# Altium schematic sheet Microcontroller.SchDoc
size E; DocumentNumber: 2; SheetNumber: 2; SheetTotal: 4
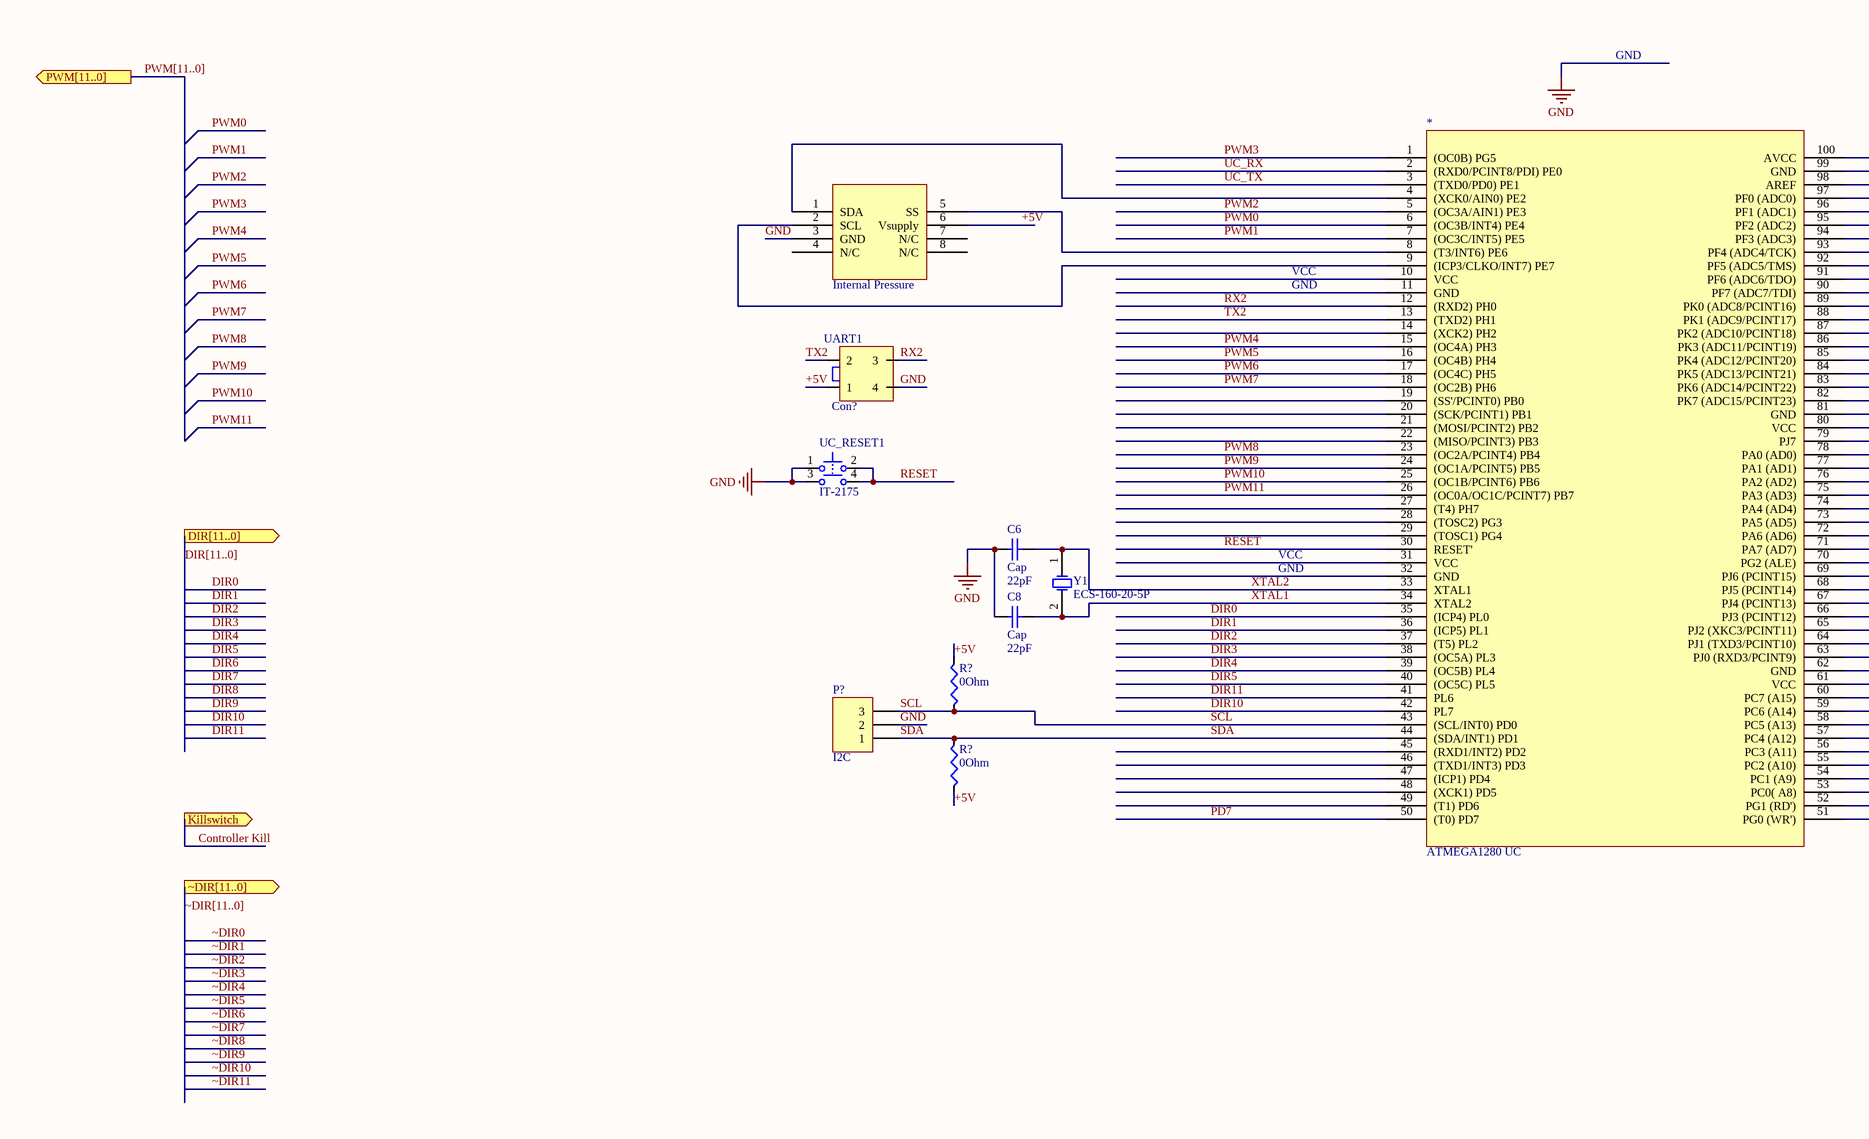
[diagram p0: Microcontroller.SchDoc, left]
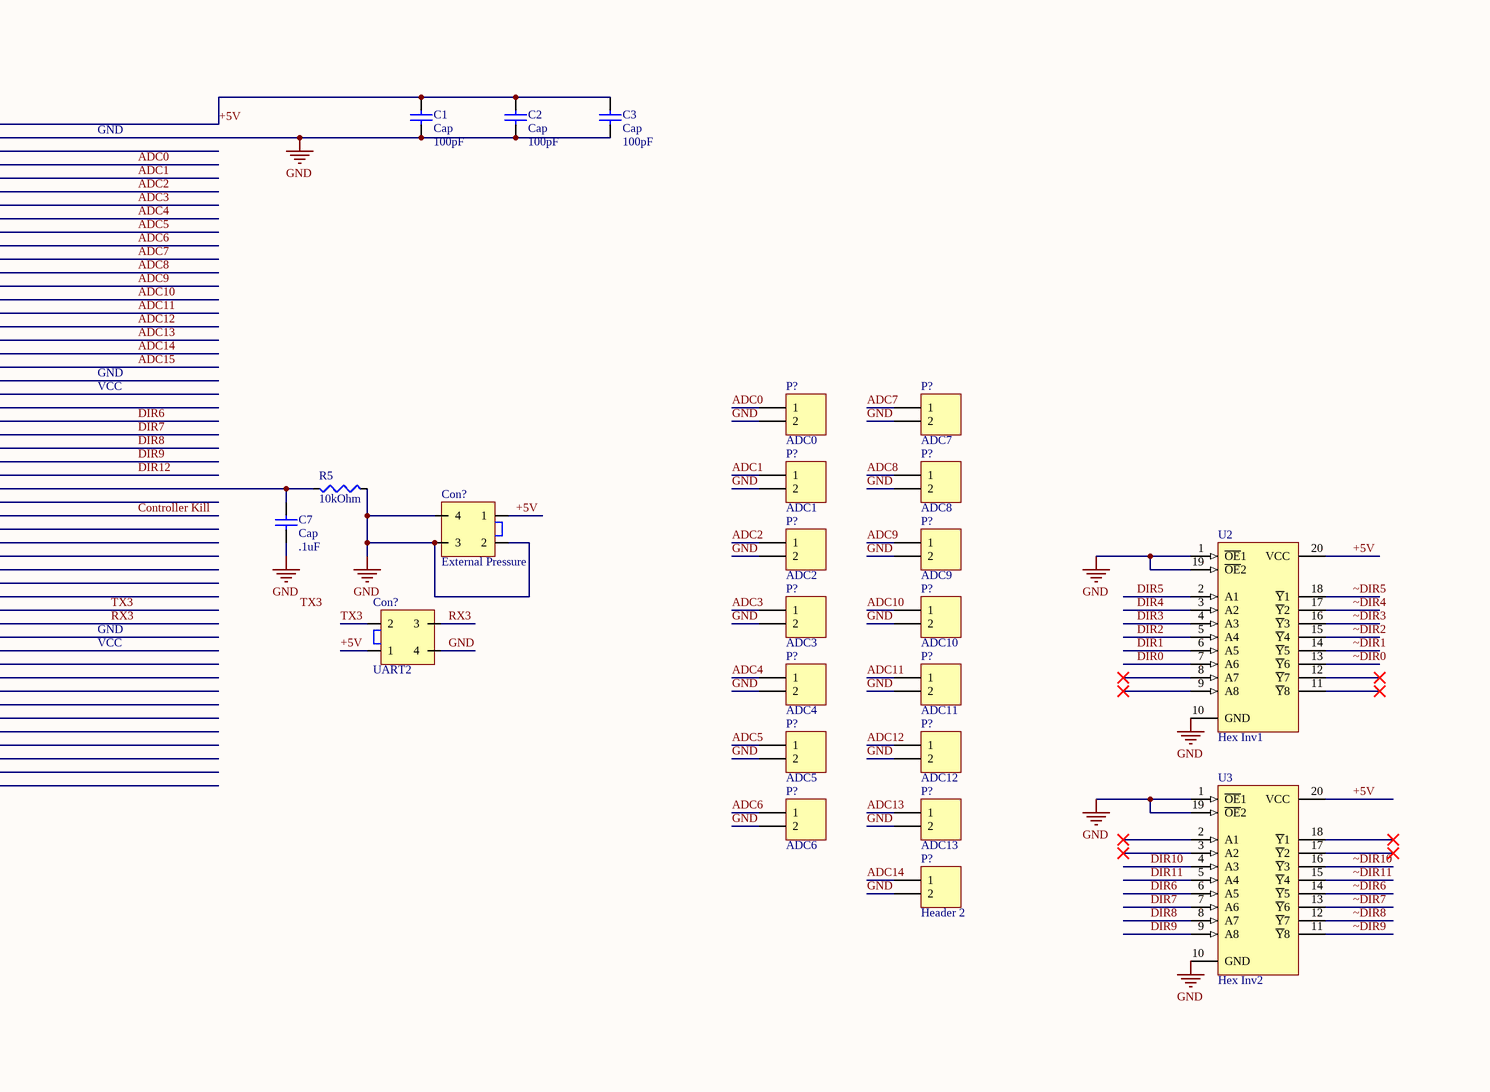
[diagram p1: Microcontroller.SchDoc, middle]
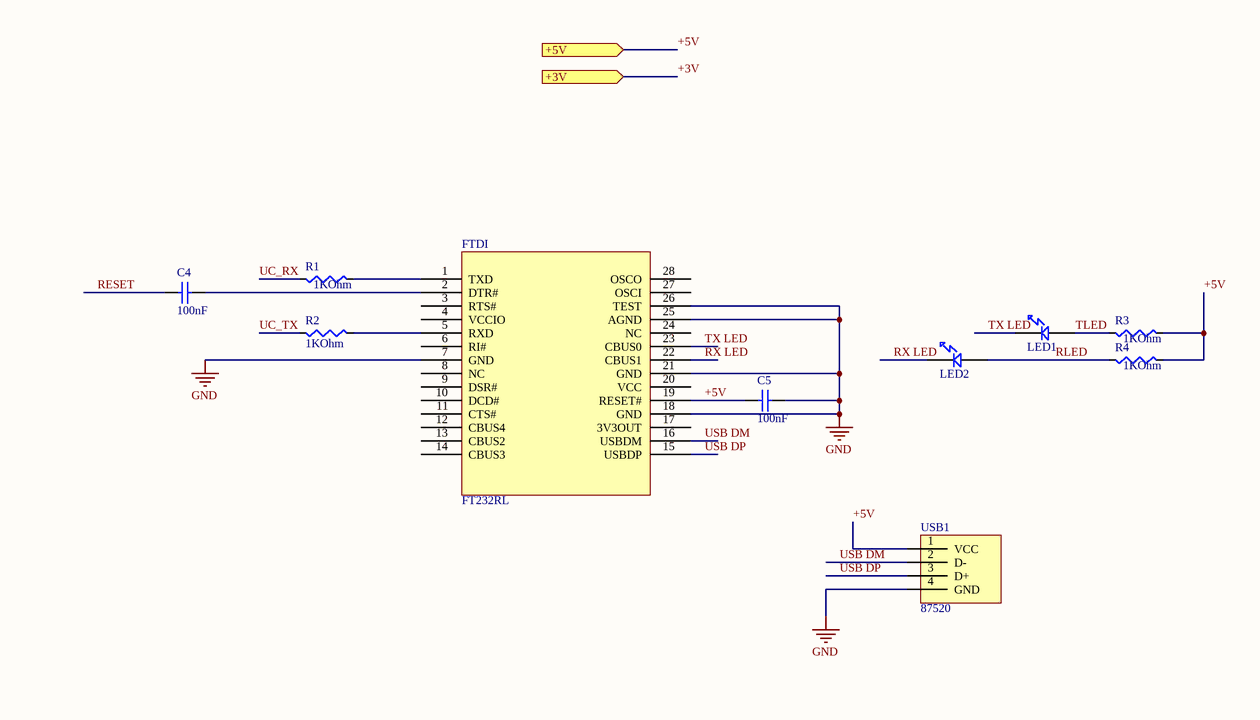
[diagram p2: Microcontroller.SchDoc, right]

## Parts
(Parts that share a designator on the sheet are numbered #1, #2 ... from top to bottom, then left to right.)
*  ATMEGA1280 UC  [TSQFP50P1600X1600X120-100N]
?  Internal Pressure  [SOP254P1740X1413-8N]
C1  Cap  value 100pF  [0805 (2012) Capacitor]
C2  Cap  value 100pF  [0805 (2012) Capacitor]
C3  Cap  value 100pF  [0805 (2012) Capacitor]
C4  100nF  [0805 (2012) Capacitor]
C5  100nF  [0805 (2012) Capacitor]
C6  Cap  value 22pF  [0805 (2012) Capacitor]
C7  Cap  value .1uF  [0805 (2012) Capacitor]
C8  Cap  value 22pF  [0805 (2012) Capacitor]
Con?#1  UART1  [5566-4]
Con?#2  External Pressure  [5566-4]
Con?#3  UART2  [5566-4]
FTDI  FT232RL  [SOP65P780X200-28N]
LED1  LED  [LED 0805]  (value not drawn)
LED2  LED  [LED 0805]  (value not drawn)
P?#1  ADC0  [HDR1X2]
P?#2  ADC7  [HDR1X2]
P?#3  ADC1  [HDR1X2]
P?#4  ADC8  [HDR1X2]
P?#5  ADC2  [HDR1X2]
P?#6  ADC9  [HDR1X2]
P?#7  ADC3  [HDR1X2]
P?#8  ADC10  [HDR1X2]
P?#9  ADC4  [HDR1X2]
P?#10  ADC11  [HDR1X2]
P?#11  I2C  [HDR1X3]
P?#12  ADC5  [HDR1X2]
P?#13  ADC12  [HDR1X2]
P?#14  ADC6  [HDR1X2]
P?#15  ADC13  [HDR1X2]
P?#16  Header 2  [HDR1X2]
R1  1KOhm  [R 0805 (2012) RESISTOR]
R2  1KOhm  [R 0805 (2012) RESISTOR]
R3  1KOhm  [R 0805 (2012) RESISTOR]
R4  1KOhm  [R 0805 (2012) RESISTOR]
R5  10kOhm  [R 0805 (2012) RESISTOR]
R?#1  0Ohm  [R 1210 (3225) RESISTOR]
R?#2  0Ohm  [R 1210 (3225) RESISTOR]
U2  Hex Inv1  [DW020_N]
U3  Hex Inv2  [DW020_N]
UC_RESET1  IT-2175  [IT-2175]
USB1  87520  [87520-0010BLF]
Y1  ECS-160-20-5P  [CSM-7]

## Ports
+3V (in), +5V (in), DIR[11..0] (out), Killswitch (out), PWM[11..0] (out), ~DIR[11..0] (out)

## Nets
GND: *.11(GND) *.32(GND) *.62(GND) *.81(GND) *.99(GND) ?.3(GND) C1.1 C2.1 C3.1 C5.2 C6.1 C7.2 C8.1 Con?#1.4 Con?#2.2 Con?#2.3 Con?#2.4 Con?#3.4 FTDI.7(GND) FTDI.18(GND) FTDI.21(GND) FTDI.25(AGND) FTDI.26(TEST) P?#1.2 P?#2.2 P?#3.2 P?#4.2 P?#5.2 P?#6.2 P?#7.2 P?#8.2 P?#9.2 P?#10.2 P?#11.2 P?#12.2 P?#13.2 P?#14.2 P?#15.2 P?#16.2 R5.2 U2.1(~{OE}1) U2.10(GND) U2.19(~{OE}2) U3.1(~{OE}1) U3.10(GND) U3.19(~{OE}2) UC_RESET1.1 UC_RESET1.3 USB1.4(GND)
+3V: port +3V
+5V: *.100(AVCC) ?.6(Vsupply) C1.2 C2.2 C3.2 C5.1 Con?#1.1 Con?#2.1 Con?#3.1 FTDI.19(RESET#) R3.2 R4.2 R?#1.2 R?#2.1 U2.20(VCC) U3.20(VCC) USB1.1(VCC) ; port +5V
ADC0: *.97(PF0_(ADC0)) P?#1.1
ADC1: *.96(PF1_(ADC1)) P?#3.1
ADC2: *.95(PF2_(ADC2)) P?#5.1
ADC3: *.94(PF3_(ADC3)) P?#7.1
ADC4: *.93(PF4_(ADC4/TCK)) P?#9.1
ADC5: *.92(PF5_(ADC5/TMS)) P?#12.1
ADC6: *.91(PF6_(ADC6/TDO)) P?#14.1
ADC7: *.90(PF7_(ADC7/TDI)) P?#2.1
ADC8: *.89(PK0_(ADC8/PCINT16)) P?#4.1
ADC9: *.88(PK1_(ADC9/PCINT17)) P?#6.1
ADC10: *.87(PK2_(ADC10/PCINT18)) P?#8.1
ADC11: *.86(PK3_(ADC11/PCINT19)) P?#10.1
ADC12: *.85(PK4_(ADC12/PCINT20)) P?#13.1
ADC13: *.84(PK5_(ADC13/PCINT21)) P?#15.1
ADC14: *.83(PK6_(ADC14/PCINT22)) P?#16.1
ADC15: *.82(PK7_(ADC15/PCINT23))
Controller Kill: *.71(PA7_(AD7)) ; port Killswitch
DIR0: *.35((ICP4)_PL0) U2.7(A6)
DIR1: *.36((ICP5)_PL1) U2.6(A5)
DIR2: *.37((T5)_PL2) U2.5(A4)
DIR3: *.38((OC5A)_PL3) U2.4(A3)
DIR4: *.39((OC5B)_PL4) U2.3(A2)
DIR5: *.40((OC5C)_PL5) U2.2(A1)
DIR6: *.78(PA0_(AD0)) U3.6(A5)
DIR7: *.77(PA1_(AD1)) U3.7(A6)
DIR8: *.76(PA2_(AD2)) U3.8(A7)
DIR9: *.75(PA3_(AD3)) U3.9(A8)
DIR10: *.42(PL7) U3.4(A3)
DIR11: *.41(PL6) U3.5(A4)
DIR12: *.74(PA4_(AD4))
PD7: *.50((T0)_PD7)
PWM0: *.6((OC3B/INT4)_PE4)
PWM1: *.7((OC3C/INT5)_PE5)
PWM2: *.5((OC3A/AIN1)_PE3)
PWM3: *.1((OC0B)_PG5)
PWM4: *.15((OC4A)_PH3)
PWM5: *.16((OC4B)_PH4)
PWM6: *.17((OC4C)_PH5)
PWM7: *.18((OC2B)_PH6)
PWM8: *.23((OC2A/PCINT4)_PB4)
PWM9: *.24((OC1A/PCINT5)_PB5)
PWM10: *.25((OC1B/PCINT6)_PB6)
PWM11: *.26((OC0A/OC1C/PCINT7)_PB7)
RESET: *.30(RESET') C4.1 UC_RESET1.2 UC_RESET1.4
RLED: LED2.2 R4.1
RX2: *.12((RXD2)_PH0) Con?#1.3
RX3: *.63(PJ0_(RXD3/PCINT9)) Con?#3.3
RX LED: FTDI.22(CBUS1) LED2.1
SCL: *.43((SCL/INT0)_PD0) P?#11.3 R?#1.1
SDA: *.44((SDA/INT1)_PD1) P?#11.1 R?#2.2
TLED: LED1.2 R3.1
TX2: *.13((TXD2)_PH1) Con?#1.2
TX3: *.64(PJ1_(TXD3/PCINT10)) Con?#3.2
TX LED: FTDI.23(CBUS0) LED1.1
UC_RX: *.2((RXD0/PCINT8/PDI)_PE0) R1.1
UC_TX: *.3((TXD0/PD0)_PE1) R2.1
USB DM: FTDI.16(USBDM) USB1.2(D-)
USB DP: FTDI.15(USBDP) USB1.3(D+)
VCC: *.10(VCC) *.31(VCC) *.61(VCC) *.80(VCC)
XTAL1: *.34(XTAL2) C8.2 Y1.2(OSC2)
XTAL2: *.33(XTAL1) C6.2 Y1.1(OSC1)
~DIR0: U2.13(~{Y}6)
~DIR1: U2.14(~{Y}5)
~DIR2: U2.15(~{Y}4)
~DIR3: U2.16(~{Y}3)
~DIR4: U2.17(~{Y}2)
~DIR5: U2.18(~{Y}1)
~DIR6: U3.14(~{Y}5)
~DIR7: U3.13(~{Y}6)
~DIR8: U3.12(~{Y}7)
~DIR9: U3.11(~{Y}8)
~DIR10: U3.16(~{Y}3)
~DIR11: U3.15(~{Y}4)
Net*_4: *.4((XCK0/AIN0)_PE2) ?.1(SDA)
Net*_8: *.8((T3/INT6)_PE6) ?.5(SS)
Net*_9: *.9((ICP3/CLKO/INT7)_PE7) ?.2(SCL)
Net*_73: *.73(PA5_(AD5)) C7.1 R5.1
NetC4_2: C4.2 FTDI.2(DTR#)
NetFTDI_1: FTDI.1(TXD) R1.2
NetFTDI_5: FTDI.5(RXD) R2.2

Not connected (* = marked no-connect by the designer): * 14((XCK2)_PH2) 19((SS'/PCINT0)_PB0) 20((SCK/PCINT1)_PB1) 21((MOSI/PCINT2)_PB2) 22((MISO/PCINT3)_PB3) 27((T4)_PH7) 28((TOSC2)_PG3) 29((TOSC1)_PG4) 45((RXD1/INT2)_PD2) 46((TXD1/INT3)_PD3) 47((ICP1)_PD4) 48((XCK1)_PD5) 49((T1)_PD6) 51(PG0_(WR')) 52(PG1_(RD')) 53(PC0(_A8)) 54(PC1_(A9)) 55(PC2_(A10)) 56(PC3_(A11)) 57(PC4_(A12)) 58(PC5_(A13)) 59(PC6_(A14)) 60(PC7_(A15)) 65(PJ2_(XKC3/PCINT11)) 66(PJ3_(PCINT12)) 67(PJ4_(PCINT13)) 68(PJ5_(PCINT14)) 69(PJ6_(PCINT15)) 70(PG2_(ALE)) 72(PA6_(AD6)) 79(PJ7) 98(AREF); ? 4(N/C) 7(N/C) 8(N/C); FTDI 3(RTS#) 4(VCCIO) 6(RI#) 8(NC) 9(DSR#) 10(DCD#) 11(CTS#) 12(CBUS4) 13(CBUS2) 14(CBUS3) 17(3V3OUT) 20(VCC) 24(NC) 27(OSCI) 28(OSCO); U2 8(A7)* 9(A8)* 11(~{Y}8)* 12(~{Y}7)*; U3 2(A1)* 3(A2)* 17(~{Y}2)* 18(~{Y}1)*

## Buses and harness runs
bus DIR[11..0] = port DIR[11..0]
bus PWM[11..0] = port PWM[11..0]
bus ~DIR[11..0] = port ~DIR[11..0]

## Notes on the sheet
- Labels drawn without touching a wire or pin: TX3

## Library data of the parts
* ? FTDI = Component_1
C1-C3 C6-C8 = Cap: Capacitor; Published: 8-Jun-2000; LatestRevisionDate: 17-Jul-2002; LatestRevisionNote: Re-released for DXP Platform.; PackageReference: RAD-0.3; Publisher: Altium Limited
C4 C5 = Capacitor (non-polarized): Capacitor; Value: .1uF
Con?#1-Con?#3 = 5566-4: 4.20mm (.165") Pitch Mini-Fit Jr.™ Header, Dual Row, Vertical, without Snap-in Plastic Peg PCB Lock, 4 Circuits, PA Polyamide Nylon 6/6 94V-2, Tin (Sn) Plating, without Drain Holes
LED1 LED2 = LED: Standard LED
P?#1-P?#10 P?#12-P?#16 = Header 2: Header, 2-Pin; LatestRevisionDate: 17-Jul-2002; LatestRevisionNote: Re-released for DXP Platform.; Publisher: Altium Limited
P?#11 = Header 3: Header, 3-Pin; LatestRevisionDate: 17-Jul-2002; LatestRevisionNote: Re-released for DXP Platform.; Publisher: Altium Limited
R1-R5 = Resistor: Value: 0Ohm
R?#1 R?#2 = Resistor: Value: 0Ohm
U2 U3 = SN74HCT540DW: Octal Buffer and Line Driver with 3-State Outputs; Published: 8-Jun-2000; LatestRevisionDate: 13-Apr-2006; LatestRevisionNote: IPC-7351 Footprint Added.; DatasheetVersion: May-1997; PackageVersion: Mar-2000; PackageReference: DW020; Publisher: Altium Limited; PackageDescription: 20-Pin Plastic Small Outline Integrated Circuit 1.27 mm Pitch; Code_JEDEC: MS-013; Code_IPC: SOIC127P1030-20; ComponentLink1Description: Manufacturer Link; ComponentLink1URL: http://www.ti.com/; ComponentLink2Description: Datasheet; ComponentLink2URL: http://www-s.ti.com/sc/ds/sn74hct540.pdf
UC_RESET1 = IT-2175: Tactile Switch, DPST; Thru-Hole; Vertical; Rating DC 12V, 50mA (max); PackageDocument: Rev.0; Published: 6-Jun-2005; DatasheetDocument: Rev.0; PackageReference: IT-2175; Publisher: Altium Limited; ComponentLink1Description: Manufacturer Link; ComponentLink1URL: http://www.ilswitch.com/; ComponentLink2Description: Device Overview; ComponentLink2URL: http://www.ilswitch.com/list.php?ac_id=010112&ai_id=91
USB1 = 87520: 87520 USB Through Hole Type A Right Angle Receptacle
Y1 = ECS-120-32-1: Crystal Oscillator; Published: 17-Jul-2002; DatasheetDocument: 18-Apr-2000; PackageReference: HC-49U; Publisher: Altium Limited; ComponentLink1Description: Manufacturer Link; ComponentLink1URL: http://www.ecsxtal.com/; ComponentLink2Description: Datasheet; ComponentLink2URL: http://www.ecsxtal.com/pdf2/HC49U.PDF